# EAGLE schematic BitReceptor_Type_02 (EAGLE 7.3.0)
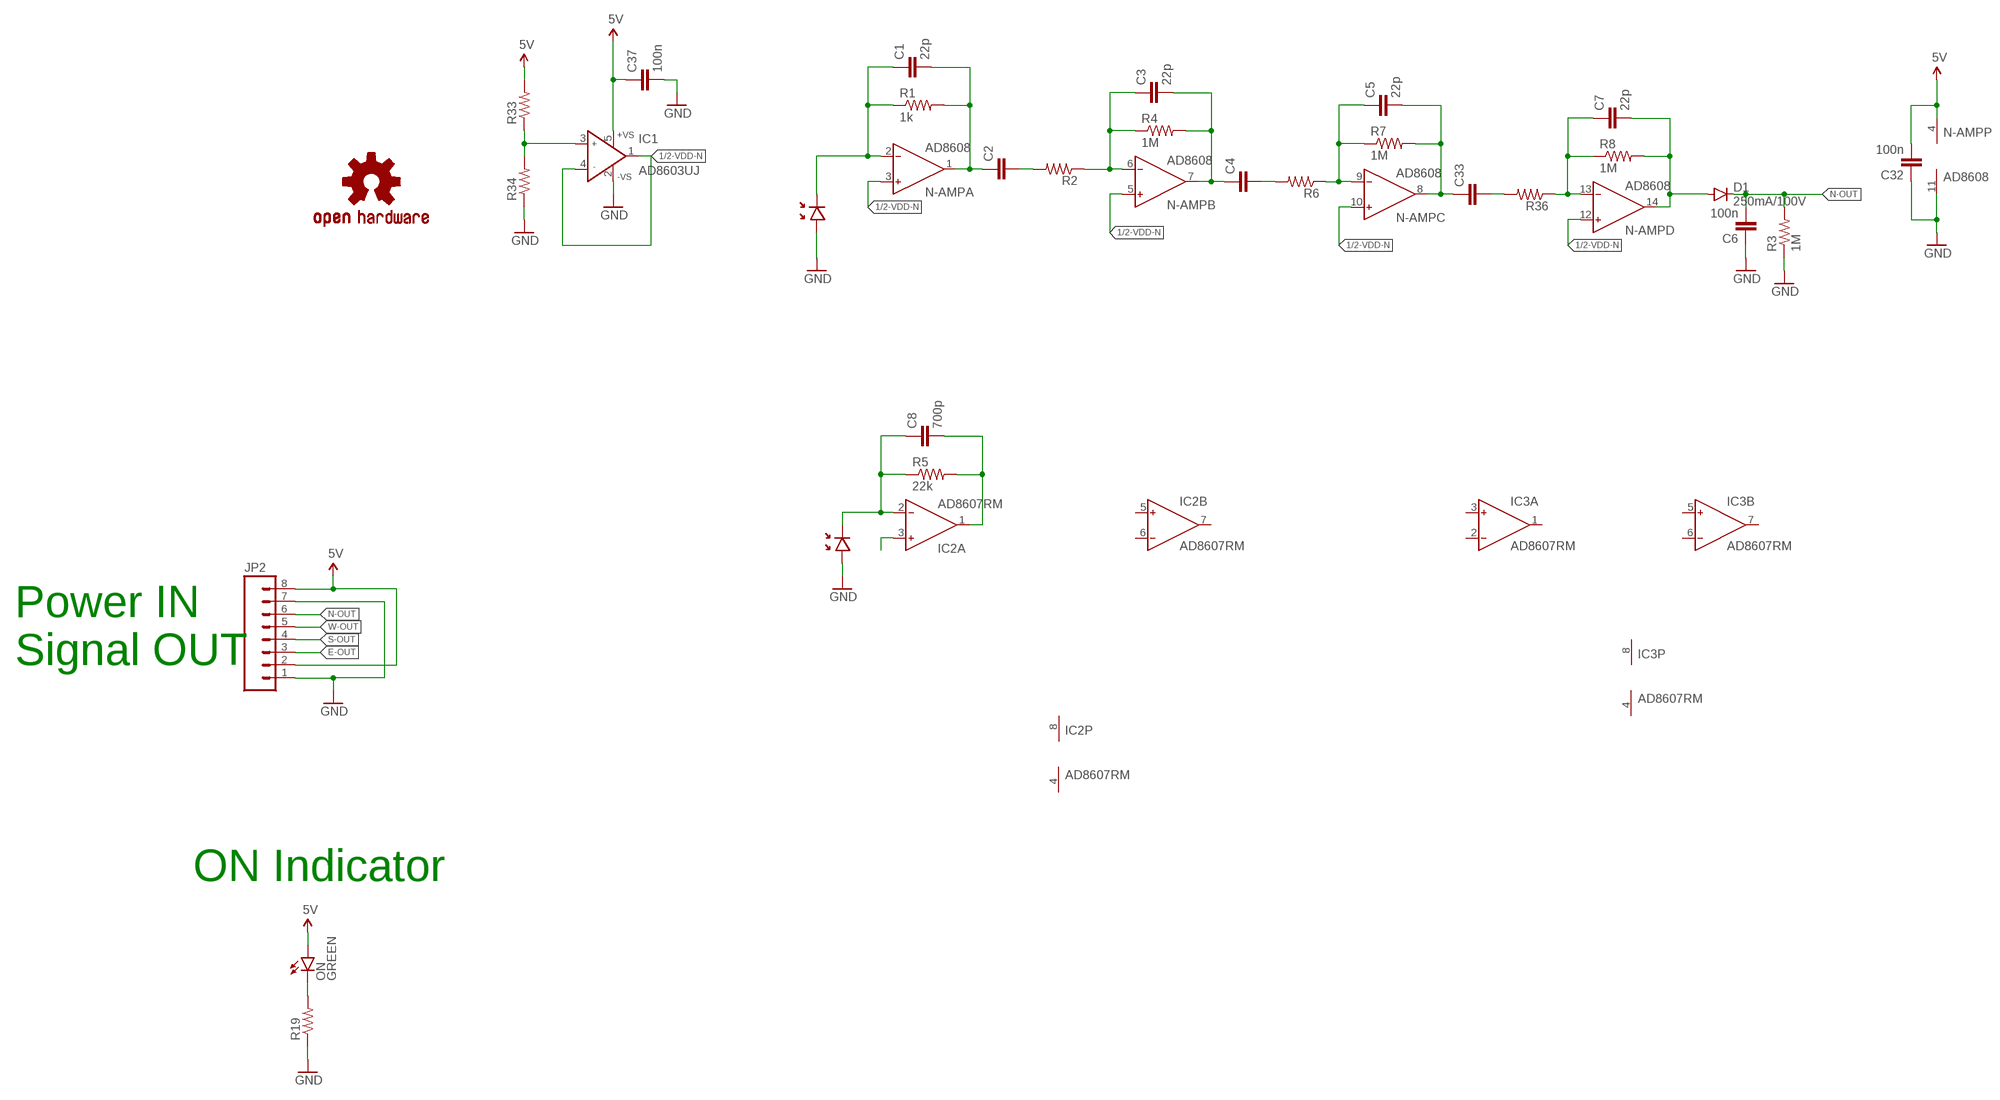
[diagram p0: schematic, sheet 1]

## Parts
C1  22p  C-EUC0402  [C0402]
C2  C-EUC0402  [C0402]
C3  22p  C-EUC0402  [C0402]
C4  C-EUC0402  [C0402]
C5  22p  C-EUC0402  [C0402]
C6  100n  C-EUC0402  [C0402]
C7  22p  C-EUC0402  [C0402]
C8  700p  C-EUC0402  [C0402]
C32  100n  C-EUC0402  [C0402]
C33  C-EUC0402  [C0402]
C37  100n  C-EUC0402  [C0402]
D1  250mA/100V  DIODEBAS16  [SOD-323]
IC1  AD8603UJ  [SOT23-5]
IC2  AD8607RM  [MSOP08]
IC3  AD8607RM  [MSOP08]
JP2  M08NO_SILK  [1X08_PIN1_NO_SILK]
LOGO1  OSHW-LOGOS  [OSHW-LOGO-S]
N-AMP  AD8608  AD8609RU  [TSSOP14]
N-PD1  BPW46  [PIN-PHOTODIODE]
N-PD2  BPW46  [PIN-PHOTODIODE]
ON  GREEN  LED-GREEN0603  [LED-0603]
R1  1k  R-US_R0402  [R0402]
R2  R-US_R0402  [R0402]
R3  1M  R-US_R0402  [R0402]
R4  1M  R-US_R0402  [R0402]
R5  22k  R-US_R0402  [R0402]
R6  R-US_R0402  [R0402]
R7  1M  R-US_R0402  [R0402]
R8  1M  R-US_R0402  [R0402]
R19  R-US_R0402  [R0402]
R33  R-US_R0402  [R0402]
R34  R-US_R0402  [R0402]
R36  R-US_R0402  [R0402]

## Nets
1/2-VDD-N: IC1.1(OUT) IC1.4(IN-) N-AMP.3(A:IN+) N-AMP.5(B:IN+) N-AMP.10(C:IN+) N-AMP.12(D:IN+)
5V: C32.2 C37.1 IC1.5(+VS) JP2.2 JP2.8 N-AMP.4(P:V+) ON.A R33.2
E-OUT: JP2.3
GND: C6.1 C32.1 C37.2 IC1.2(-VS) JP2.1 JP2.7 N-AMP.11(P:V-) N-PD1.1(+) N-PD2.1(+) R3.1 R19.1 R34.1
N$1: C1.1 N-AMP.2(A:IN-) N-PD1.2(-) R1.1
N$2: C8.1 IC2.2(A:IN-) N-PD2.2(-) R5.1
N$3: C1.2 C2.1 N-AMP.1(A:OUT) R1.2
N$4: C8.2 IC2.1(A:OUT) R5.2
N$5: C3.1 N-AMP.6(B:IN-) R2.1 R4.1
N$6: C3.2 C4.1 N-AMP.7(B:OUT) R4.2
N$7: C5.1 N-AMP.9(C:IN-) R6.1 R7.1
N$8: C5.2 C33.1 N-AMP.8(C:OUT) R7.2
N$9: IC1.3(IN+) R33.1 R34.2
N$10: C7.1 N-AMP.13(D:IN-) R8.1 R36.1
N$11: C7.2 D1.A N-AMP.14(D:OUT) R8.2
N$27: C2.2 R2.2
N$34: C4.2 R6.2
N$35: C33.2 R36.2
N$48: ON.C R19.2
N-OUT: C6.2 D1.C JP2.6 R3.2
S-OUT: JP2.4
VREF: IC2.3(A:IN+)
W-OUT: JP2.5
Unconnected: IC2.5(B:IN+) IC2.6(B:IN-) IC2.7(B:OUT) IC3.1(A:OUT) IC3.2(A:IN-) IC3.3(A:IN+) IC3.5(B:IN+) IC3.6(B:IN-) IC3.7(B:OUT)

## Notes on the sheet
- Power IN
  Signal OUT
- ON Indicator

## Power pins joined to a net without a drawn wire
V+: IC2.8(P:V+) IC3.8(P:V+)
V-: IC2.4(P:V-) IC3.4(P:V-)

## Library data of the parts
C1-C8 C32 C33 C37 = resistor:C-EU: CAPACITOR, European symbol
D1 = SparkFun-DiscreteSemi:DIODE: Diode These are standard reverse protection diodes and small signal diodes. SMA package can handle up to about 1A. SOD-323 can handle about 200mA. What the SOD-323 package when ordering, there are some mfgs out there that are 5-pin packages.; PROD_ID: DIO-09646
IC1 = analog-devices:AD8603: Precision Micropower, Low Noise CMOS, Rail-to-Rail Input/Output Operational Amplifiers Source: http://www.analog.com/static/imported-files/data_sheets/AD8603_8607_8609.pdf; MF: ALTERA CORPORATION; MPN: AD8603AUJZ-REEL7; OC_FARNELL: 1651290; OC_NEWARK: 59K6904
IC2 IC3 = analog-devices:AD8607: Precision Micropower, Low Noise CMOS, Rail-to-Rail Input/Output Operational Amplifiers Source: http://www.analog.com/static/imported-files/data_sheets/AD8603_8607_8609.pdf; MF: ALTERA CORPORATION; MPN: AD8607ARMZ-REEL; OC_FARNELL: 1464990; OC_NEWARK: 59K6925
JP2 = SparkFun-Connectors:M08: Header 8 Standard 8-pin 0.1" header. Use with straight break away headers (SKU : PRT-00116), right angle break away headers (PRT-00553), swiss pins (PRT-00743), machine pins (PRT-00117), and female headers (PRT-00115).
LOGO1 = SparkFun-Aesthetics:OSHW-LOGO: Open Source Hardware Logo This logo indicates the piece of hardware it is found on incorporates a OSHW license and/or adheres to the definition of open source hardware found here: http://freedomdefined.org/OSHW
N-AMP = analog-devices:AD8609: Precision Micropower, Low Noise CMOS, Rail-to-Rail Input/Output Operational Amplifiers Source: http://www.analog.com/static/imported-files/data_sheets/AD8603_8607_8609.pdf; MF: ALTERA CORPORATION; MPN: AD8609ARUZ; OC_FARNELL: 1464994; OC_NEWARK: 59K6934
N-PD1 N-PD2 = Orlando:BPW46
ON = SparkFun-LED:LED-GREEN: Various green LEDs Green LEDs used in SFE Production 0603- DIO-00821 LARGE- DIO-00862 LILYPAD- DIO-09910; PROD_ID: DIO-00821
R1-R8 R19 R33 R34 R36 = resistor:R-US_: RESISTOR, American symbol